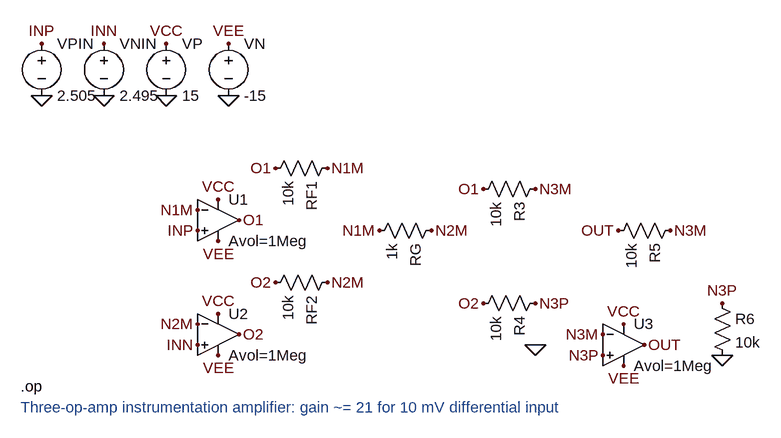
[diagram p0: schematic 19_instrumentation_amplifier.asc]
19_instrumentation_amplifier.asc, the LTspice schematic file:
Version 4
SHEET 1 1240 820
FLAG 80 96 INP
FLAG 80 176 0
FLAG 176 96 INN
FLAG 176 176 0
FLAG 272 96 VCC
FLAG 272 176 0
FLAG 368 96 VEE
FLAG 368 176 0
FLAG 320 384 INP
FLAG 320 352 N1M
FLAG 384 368 O1
FLAG 352 336 VCC
FLAG 352 400 VEE
FLAG 320 560 INN
FLAG 320 528 N2M
FLAG 384 544 O2
FLAG 352 512 VCC
FLAG 352 576 VEE
FLAG 520 288 N1M
FLAG 440 288 O1
FLAG 520 464 N2M
FLAG 440 464 O2
FLAG 600 384 N1M
FLAG 680 384 N2M
FLAG 760 320 O1
FLAG 840 320 N3M
FLAG 760 496 O2
FLAG 840 496 N3P
FLAG 840 560 0
FLAG 944 576 N3P
FLAG 944 544 N3M
FLAG 1008 560 OUT
FLAG 976 528 VCC
FLAG 976 592 VEE
FLAG 1048 384 N3M
FLAG 968 384 OUT
FLAG 1128 496 N3P
FLAG 1128 576 0
SYMBOL voltage 80 80 R0
SYMATTR InstName VPIN
SYMATTR Value 2.505
SYMBOL voltage 176 80 R0
SYMATTR InstName VNIN
SYMATTR Value 2.495
SYMBOL voltage 272 80 R0
SYMATTR InstName VP
SYMATTR Value 15
SYMBOL voltage 368 80 R0
SYMATTR InstName VN
SYMATTR Value -15
SYMBOL opamp2 352 304 R0
SYMATTR InstName U1
SYMATTR Value Avol=1Meg
SYMBOL opamp2 352 480 R0
SYMATTR InstName U2
SYMATTR Value Avol=1Meg
SYMBOL res 536 272 R90
SYMATTR InstName RF1
SYMATTR Value 10k
SYMBOL res 536 448 R90
SYMATTR InstName RF2
SYMATTR Value 10k
SYMBOL res 696 368 R90
SYMATTR InstName RG
SYMATTR Value 1k
SYMBOL res 856 304 R90
SYMATTR InstName R3
SYMATTR Value 10k
SYMBOL res 856 480 R90
SYMATTR InstName R4
SYMATTR Value 10k
SYMBOL res 1064 368 R90
SYMATTR InstName R5
SYMATTR Value 10k
SYMBOL res 1112 480 R0
SYMATTR InstName R6
SYMATTR Value 10k
SYMBOL opamp2 976 496 R0
SYMATTR InstName U3
SYMATTR Value Avol=1Meg
TEXT 48 624 Left 2 !.op
TEXT 48 656 Left 2 ;Three-op-amp instrumentation amplifier: gain ~= 21 for 10 mV differential input

The netlist it stands for:
* 19_instrumentation_amplifier.asc
VPIN INP 0 2.505
VNIN INN 0 2.495
VP VCC 0 15
VN VEE 0 -15
XU1 INP N1M VCC VEE O1 Avol=1Meg  ; pins In+ In- V+ V- OUT
XU2 INN N2M VCC VEE O2 Avol=1Meg  ; pins In+ In- V+ V- OUT
RF1 N1M O1 10k
RF2 N2M O2 10k
RG N2M N1M 1k
R3 N3M O1 10k
R4 N3P O2 10k
R5 N3M OUT 10k
R6 N3P 0 10k
XU3 N3P N3M VCC VEE OUT Avol=1Meg  ; pins In+ In- V+ V- OUT
.op
* Three-op-amp instrumentation amplifier: gain ~= 21 for 10 mV differential input
.backanno
.end